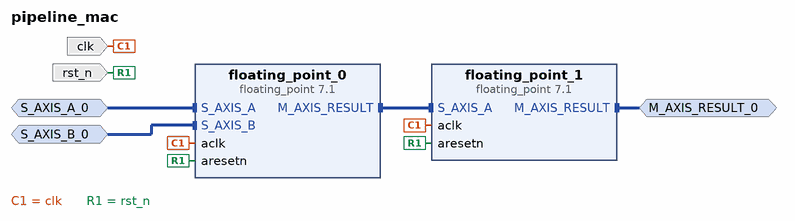
[diagram p0: block diagram of the top level]
# Vivado block design pipeline_mac, xc7vx485tffg1761-2, Vivado 2021.1
create_bd_design pipeline_mac

create_bd_intf_port -mode Master -vlnv xilinx.com:interface:axis_rtl:1.0 M_AXIS_RESULT_0
create_bd_intf_port -mode Slave -vlnv xilinx.com:interface:axis_rtl:1.0 S_AXIS_B_0
set_property -dict [list \
  CONFIG.HAS_TKEEP 0 \
  CONFIG.HAS_TLAST 0 \
  CONFIG.HAS_TREADY 1 \
  CONFIG.HAS_TSTRB 0 \
  CONFIG.LAYERED_METADATA undef \
  CONFIG.TDATA_NUM_BYTES 2 \
  CONFIG.TDEST_WIDTH 0 \
  CONFIG.TID_WIDTH 0 \
  CONFIG.TUSER_WIDTH 0 \
] [get_bd_intf_ports S_AXIS_B_0]
create_bd_intf_port -mode Slave -vlnv xilinx.com:interface:axis_rtl:1.0 S_AXIS_A_0
set_property -dict [list \
  CONFIG.HAS_TKEEP 0 \
  CONFIG.HAS_TLAST 0 \
  CONFIG.HAS_TREADY 1 \
  CONFIG.HAS_TSTRB 0 \
  CONFIG.LAYERED_METADATA undef \
  CONFIG.TDATA_NUM_BYTES 2 \
  CONFIG.TDEST_WIDTH 0 \
  CONFIG.TID_WIDTH 0 \
  CONFIG.TUSER_WIDTH 0 \
] [get_bd_intf_ports S_AXIS_A_0]
create_bd_port -dir I -type rst rst_n
create_bd_port -dir I -type clk clk
set_property -dict {CONFIG.ASSOCIATED_RESET rst_n CONFIG.FREQ_HZ 100000000} [get_bd_ports clk]

create_bd_cell -type ip -vlnv xilinx.com:ip:floating_point:7.1 floating_point_0
set_property -dict [list \
  CONFIG.A_Precision_Type Half \
  CONFIG.C_Accum_Input_Msb 15 \
  CONFIG.C_Accum_Lsb -24 \
  CONFIG.C_Accum_Msb 32 \
  CONFIG.C_Latency 4 \
  CONFIG.C_Mult_Usage Full_Usage \
  CONFIG.C_Rate 1 \
  CONFIG.C_Result_Exponent_Width 5 \
  CONFIG.C_Result_Fraction_Width 11 \
  CONFIG.Has_ARESETn true \
  CONFIG.Maximum_Latency false \
  CONFIG.Operation_Type Multiply \
  CONFIG.Result_Precision_Type Half \
] [get_bd_cells floating_point_0]
create_bd_cell -type ip -vlnv xilinx.com:ip:floating_point:7.1 floating_point_1
set_property -dict [list \
  CONFIG.A_Precision_Type Half \
  CONFIG.Add_Sub_Value Add \
  CONFIG.C_Accum_Input_Msb 15 \
  CONFIG.C_Accum_Lsb -24 \
  CONFIG.C_Accum_Msb 32 \
  CONFIG.C_Latency 12 \
  CONFIG.C_Mult_Usage Medium_Usage \
  CONFIG.C_Optimization Low_Latency \
  CONFIG.C_Rate 1 \
  CONFIG.C_Result_Exponent_Width 5 \
  CONFIG.C_Result_Fraction_Width 11 \
  CONFIG.Has_ARESETn true \
  CONFIG.Has_A_TLAST true \
  CONFIG.Maximum_Latency false \
  CONFIG.Operation_Type Accumulator \
  CONFIG.RESULT_TLAST_Behv Pass_A_TLAST \
  CONFIG.Result_Precision_Type Half \
] [get_bd_cells floating_point_1]

# ---- connections ----

connect_bd_intf_net -intf_net S_AXIS_A_0_1 [get_bd_intf_ports S_AXIS_A_0] [get_bd_intf_pins floating_point_0/S_AXIS_A]
connect_bd_intf_net -intf_net S_AXIS_B_0_1 [get_bd_intf_ports S_AXIS_B_0] [get_bd_intf_pins floating_point_0/S_AXIS_B]
connect_bd_intf_net [get_bd_intf_pins floating_point_0/M_AXIS_RESULT] [get_bd_intf_pins floating_point_1/S_AXIS_A]
connect_bd_intf_net [get_bd_intf_ports M_AXIS_RESULT_0] [get_bd_intf_pins floating_point_1/M_AXIS_RESULT]
connect_bd_net -net aclk_0_1 [get_bd_ports clk] [get_bd_pins floating_point_0/aclk] [get_bd_pins floating_point_1/aclk]
connect_bd_net -net aresetn_0_1 [get_bd_ports rst_n] [get_bd_pins floating_point_0/aresetn] [get_bd_pins floating_point_1/aresetn]

validate_bd_design
save_bd_design
